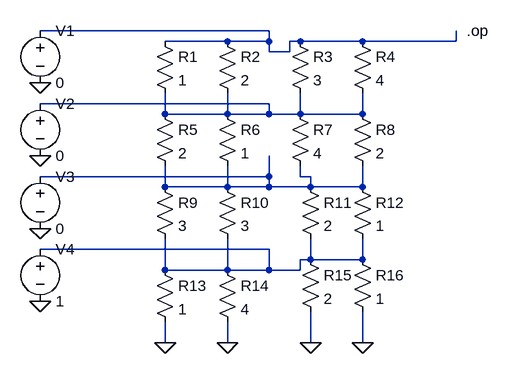
[diagram p0: schematic Challenge.asc]
Challenge.asc, the LTspice schematic file:
Version 4.1
SHEET 1 880 680
WIRE 304 48 -48 48
WIRE 240 64 144 64
WIRE 304 64 304 48
WIRE 304 64 240 64
WIRE 352 64 336 64
WIRE 448 64 352 64
WIRE 592 64 592 48
WIRE 592 64 448 64
WIRE 304 80 304 64
WIRE 336 80 336 64
WIRE 336 80 304 80
WIRE 304 160 -48 160
WIRE 144 176 144 144
WIRE 240 176 240 144
WIRE 240 176 144 176
WIRE 304 176 304 160
WIRE 304 176 240 176
WIRE 352 176 352 144
WIRE 352 176 304 176
WIRE 448 176 448 144
WIRE 448 176 352 176
WIRE 304 272 304 240
WIRE 304 272 -48 272
WIRE 352 272 352 256
WIRE 368 272 352 272
WIRE 144 288 144 256
WIRE 240 288 240 256
WIRE 240 288 144 288
WIRE 304 288 304 272
WIRE 304 288 240 288
WIRE 368 288 368 272
WIRE 368 288 304 288
WIRE 448 288 448 256
WIRE 448 288 368 288
WIRE 304 384 -48 384
WIRE 368 400 368 368
WIRE 368 400 352 400
WIRE 448 400 448 368
WIRE 448 400 368 400
WIRE 144 416 144 368
WIRE 240 416 240 368
WIRE 240 416 144 416
WIRE 304 416 304 384
WIRE 304 416 240 416
WIRE 352 416 352 400
WIRE 352 416 304 416
WIRE 144 528 144 496
WIRE 240 528 240 496
WIRE 368 528 368 480
WIRE 448 528 448 480
FLAG -48 128 0
FLAG -48 240 0
FLAG -48 352 0
FLAG -48 464 0
FLAG 144 528 0
FLAG 240 528 0
FLAG 368 528 0
FLAG 448 528 0
SYMBOL voltage -48 32 R0
WINDOW 123 0 0 Left 0
WINDOW 39 0 0 Left 0
SYMATTR InstName V1
SYMATTR Value 0
SYMBOL voltage -48 144 R0
WINDOW 123 0 0 Left 0
WINDOW 39 0 0 Left 0
SYMATTR InstName V2
SYMATTR Value 0
SYMBOL voltage -48 256 R0
WINDOW 123 0 0 Left 0
WINDOW 39 0 0 Left 0
SYMATTR InstName V3
SYMATTR Value 0
SYMBOL voltage -48 368 R0
WINDOW 123 0 0 Left 0
WINDOW 39 0 0 Left 0
SYMATTR InstName V4
SYMATTR Value 1
SYMBOL res 128 48 R0
SYMATTR InstName R1
SYMATTR Value 1
SYMBOL res 224 48 R0
SYMATTR InstName R2
SYMATTR Value 2
SYMBOL res 336 48 R0
SYMATTR InstName R3
SYMATTR Value 3
SYMBOL res 432 48 R0
SYMATTR InstName R4
SYMATTR Value 4
SYMBOL res 128 160 R0
SYMATTR InstName R5
SYMATTR Value 2
SYMBOL res 224 160 R0
SYMATTR InstName R6
SYMATTR Value 1
SYMBOL res 336 160 R0
SYMATTR InstName R7
SYMATTR Value 4
SYMBOL res 432 160 R0
SYMATTR InstName R8
SYMATTR Value 2
SYMBOL res 128 272 R0
SYMATTR InstName R9
SYMATTR Value 3
SYMBOL res 224 272 R0
SYMATTR InstName R10
SYMATTR Value 3
SYMBOL res 352 272 R0
SYMATTR InstName R11
SYMATTR Value 2
SYMBOL res 432 272 R0
SYMATTR InstName R12
SYMATTR Value 1
SYMBOL res 128 400 R0
SYMATTR InstName R13
SYMATTR Value 1
SYMBOL res 224 400 R0
SYMATTR InstName R14
SYMATTR Value 4
SYMBOL res 352 384 R0
SYMATTR InstName R15
SYMATTR Value 2
SYMBOL res 432 384 R0
SYMATTR InstName R16
SYMATTR Value 1
TEXT 608 48 Left 2 !.op

The netlist it stands for:
* Challenge.asc
V1 N001 0 0
V2 N002 0 0
V3 N003 0 0
V4 N004 0 1
R1 N001 N002 1
R2 N001 N002 2
R3 N001 N002 3
R4 N001 N002 4
R5 N002 N003 2
R6 N002 N003 1
R7 N002 N003 4
R8 N002 N003 2
R9 N003 N004 3
R10 N003 N004 3
R11 N003 N004 2
R12 N003 N004 1
R13 N004 0 1
R14 N004 0 4
R15 N004 0 2
R16 N004 0 1
.op
.backanno
.end